# Altium schematic sheet NguyenLI.SchDoc
size B
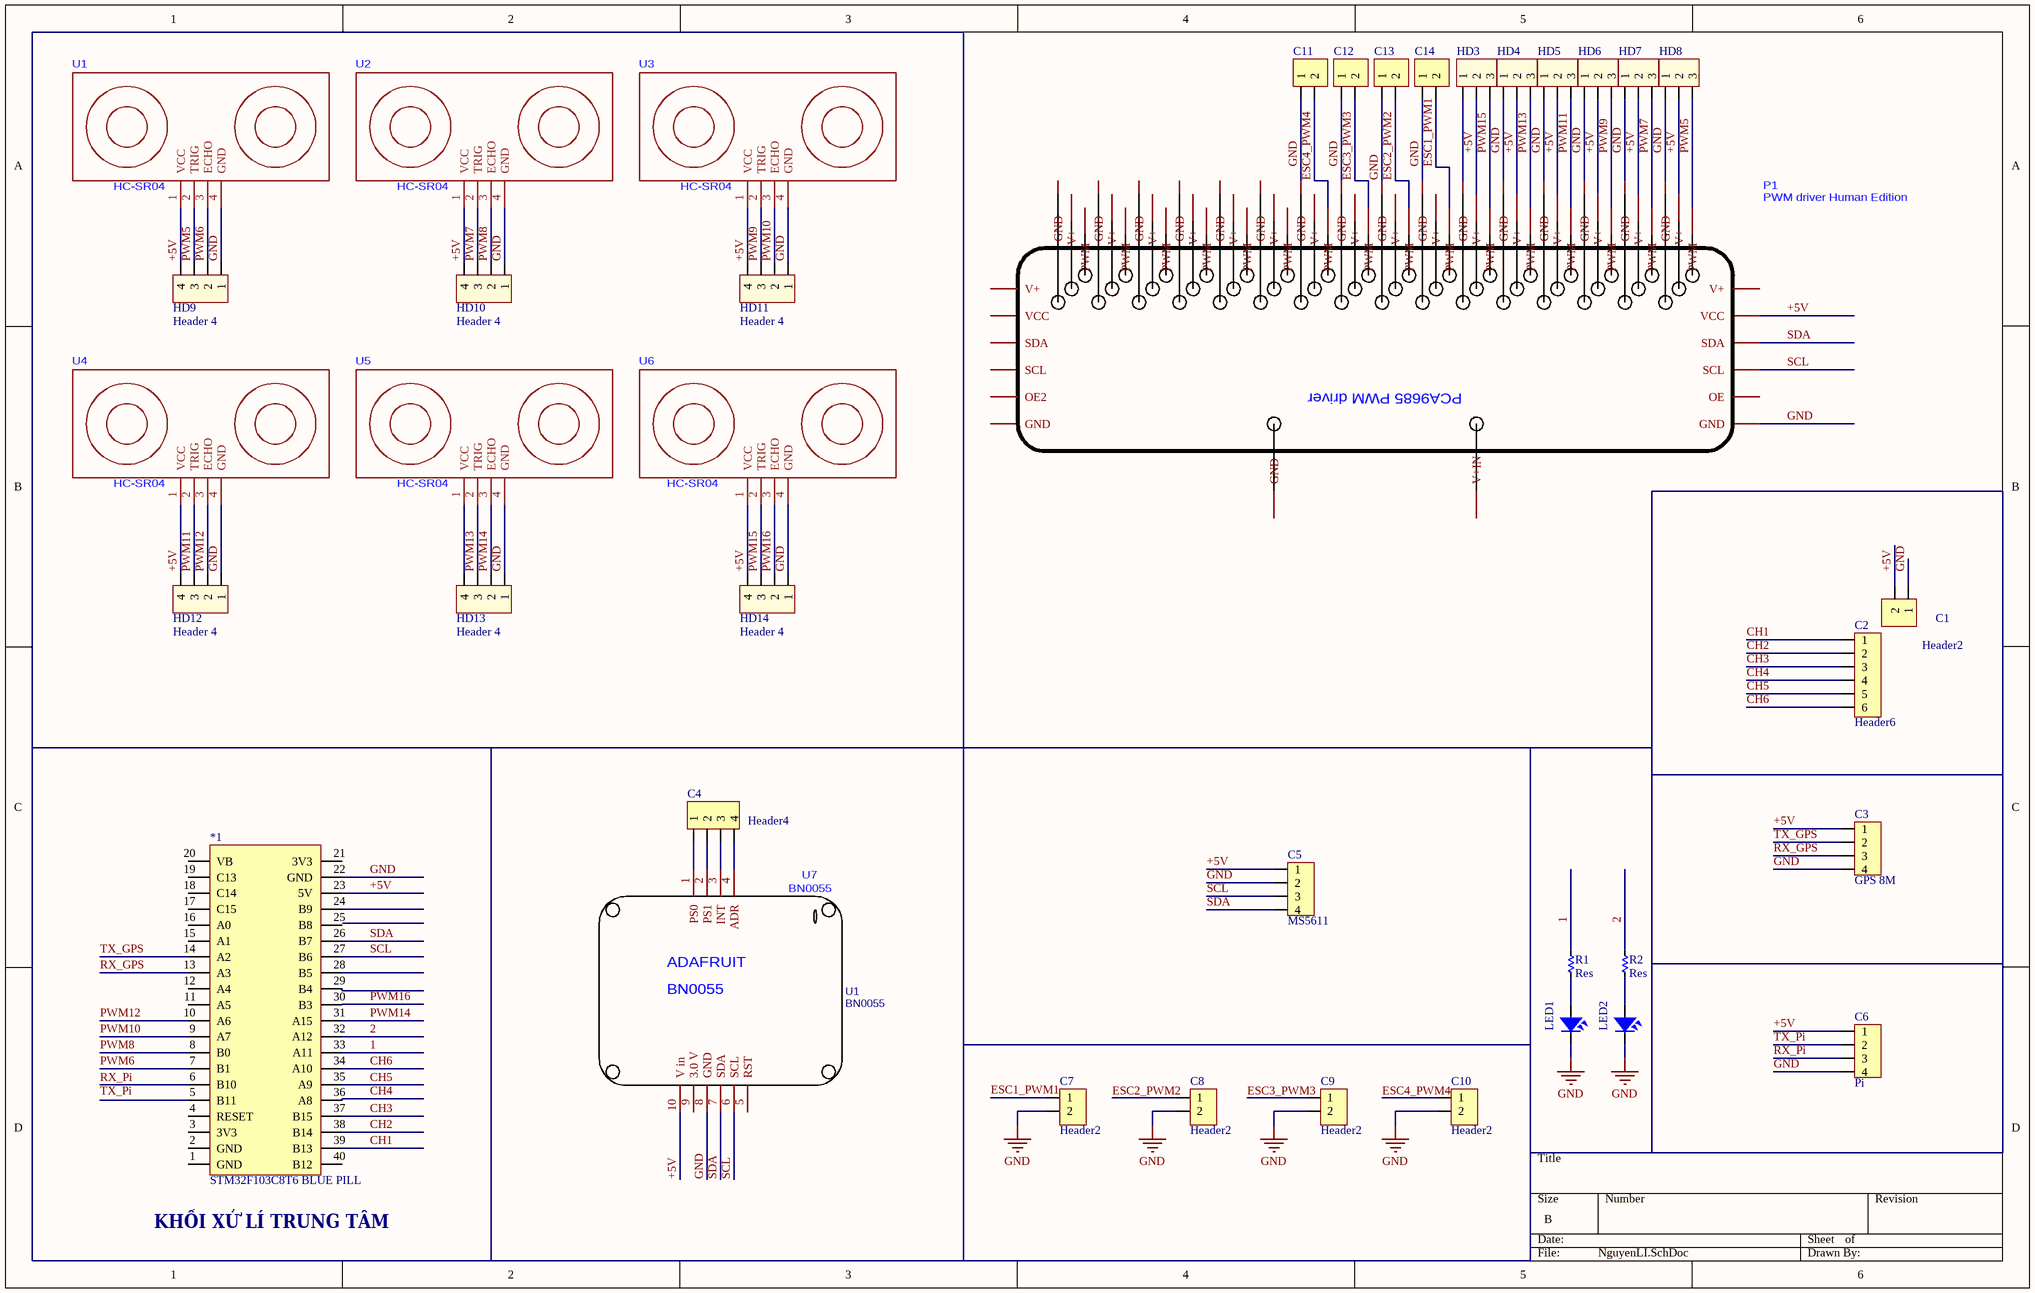
[diagram p0: NguyenLI.SchDoc]

## Parts
*1  STM32F103C8T6 BLUE PILL  [STM32F103 BLUE PILL]
C1  Header2  [HDR2]
C2  Header6  [HDR6]
C3  GPS 8M  [HDR4]
C4  Header4  [HDR4]
C5  MS5611  [HDR4]
C6  Pi  [HDR4]
C7  Header2  [HDR2]
C8  Header2  [HDR2]
C9  Header2  [HDR2]
C10  Header2  [HDR2]
C11  Header2  [HDR2]  (value not drawn)
C12  Header2  [HDR2]  (value not drawn)
C13  Header2  [HDR2]  (value not drawn)
C14  Header2  [HDR2]  (value not drawn)
HD3  (no value)  [HED3]
HD4  (no value)  [HED3]
HD5  (no value)  [HED3]
HD6  (no value)  [HED3]
HD7  (no value)  [HED3]
HD8  (no value)  [HED3]
HD9  Header 4  [HED4B]
HD10  Header 4  [HED4B]
HD11  Header 4  [HED4B]
HD12  Header 4  [HED4B]
HD13  Header 4  [HED4B]
HD14  Header 4  [HED4B]
LED1  LED  [LED-5-RED]  (value not drawn)
LED2  LED  [LED-5-RED]  (value not drawn)
P1  PWM driver Human Edition  [PCA9685]
R1  Res  [RES-1/4W]
R2  Res  [RES-1/4W]
U1  HC-SR04  [HC-SR04]
U2  HC-SR04  [HC-SR04]
U3  HC-SR04  [HC-SR04]
U4  HC-SR04  [HC-SR04]
U5  HC-SR04  [HC-SR04]
U6  HC-SR04  [HC-SR04]
U7  BN0055  [BN0055]

## Nets
GND: *1.22(GND) C1.1 C3.4 C5.2 C6.4 C7.2 C8.2 C9.2 C10.2 C11.1 C12.1 C13.1 C14.1 HD4.1 HD5.1 HD6.1 HD7.1 HD8.1 HD9.1 HD10.1 HD11.1 HD12.1 HD13.1 HD14.1 LED1.2 LED2.2 P1.1(GND) P1.9(GND) P1.12(GND) P1.15(GND) P1.18(GND) P1.21(GND) P1.27(GND) P1.30(GND) P1.33(GND) P1.36(GND) U1.4(GND) U2.4(GND) U3.4(GND) U4.4(GND) U5.4(GND) U6.4(GND) U7.8(GND)
1: *1.33(A11) R1.1
2: *1.32(A12) R2.1
+5V: *1.23(5V) C1.2 C3.1 C5.1 C6.1 HD3.2 HD4.2 HD5.2 HD6.2 HD7.2 HD8.2 HD9.4 HD10.4 HD11.4 HD12.4 HD14.4 P1.5(VCC) P1.8(V+) P1.11(V+) P1.14(V+) P1.17(V+) P1.20(V+) P1.23(V+) U1.1(VCC) U2.1(VCC) U3.1(VCC) U4.1(VCC) U6.1(VCC) U7.10(V_in)
CH1: *1.39(B13) C2.1
CH2: *1.38(B14) C2.2
CH3: *1.37(B15) C2.3
CH4: *1.36(A8) C2.4
CH5: C2.5
CH6: *1.34(A10) C2.6
ESC1_PWM1: C7.1 C14.2 P1.25(PWM)
ESC2_PWM2: C13.2 P1.28(PWM)
ESC3_PWM3: C12.2 P1.31(PWM)
ESC4_PWM4: C11.2 P1.34(PWM)
PWM5: HD8.3 HD9.3 P1.7(PWM) U1.2(TRIG)
PWM6: *1.7(B1) HD9.2 U1.3(ECHO)
PWM7: HD7.3 HD10.3 P1.10(PWM) U2.2(TRIG)
PWM8: *1.8(B0) HD10.2 U2.3(ECHO)
PWM9: HD6.3 HD11.3 P1.13(PWM) U3.2(TRIG)
PWM10: *1.9(A7) HD11.2 U3.3(ECHO)
PWM11: HD5.3 HD12.3 P1.16(PWM) U4.2(TRIG)
PWM12: *1.10(A6) HD12.2 U4.3(ECHO)
PWM13: HD4.3 HD13.3 P1.19(PWM) U5.2(TRIG)
PWM14: *1.31(A15) HD13.2 U5.3(ECHO)
PWM15: HD3.3 HD14.3 P1.22(PWM) U6.2(TRIG)
PWM16: *1.30(B3) HD14.2 U6.3(ECHO)
RX_GPS: *1.13(A3) C3.3
RX_Pi: C6.3
SCL: *1.27(B6) C5.3 P1.3(SCL) U7.6(SCL)
SDA: *1.26(B7) C5.4 P1.4(SDA) U7.7(SDA)
TX_GPS: *1.14(A2) C3.2
TX_Pi: C6.2
NetC4_1: C4.1 U7.1(PS0)
NetC4_2: C4.2 U7.2(PS1)
NetC4_3: C4.3 U7.3(INT)
NetC4_4: C4.4 U7.4(ADR)
NetHD3_1: HD3.1 P1.24(GND)
NetHD13_4: HD13.4 U5.1(VCC)
NetLED1_1: LED1.1 R1.2
NetLED2_1: LED2.1 R2.2

Not connected (* = marked no-connect by the designer): *1 1(GND) 2(GND) 3(3V3) 4(RESET) 5(B11) 6(B10) 11(A5) 12(A4) 15(A1) 16(A0) 17(C15) 18(C14) 19(C13) 20(VB) 21(3V3) 24(B9) 25(B8) 28(B5) 29(B4) 35(A9) 40(B12); C8 1; C9 1; C10 1; P1 2(OE) 6(V+) 26(V+) 29(V+) 32(V+) 35(V+) 37(PWM) 38(V+) 39(GND) 40(PWM) 41(V+) 42(GND) 43(PWM) 44(V+) 45(GND) 46(PWM) 47(V+) 48(GND) 49(PWM) 50(V+) 51(GND) 52(PWM) 53(V+) 54(GND) 55(V+) 56(VCC) 57(SDA) 58(SCL) 59(OE2) 60(GND) 61(V+IN) 62(GND); U7 5(RST) 9(3.0_V)

## Notes on the sheet
- (near *1) KHỐI XỬ LÍ TRUNG TÂM
- Labels drawn without touching a wire or pin: CH5, ESC2_PWM2, ESC3_PWM3, ESC4_PWM4, RX_Pi, TX_Pi
- (in symbol BN0055) ADAFRUIT; U1
- (in symbol PWM driver Human Edition) PCA9685 PWM driver

## Library data of the parts
C1 C7-C14 = Header2: Header IDC, 2 x 1 Pin Vertical 2.54mm Pitch (Non-Boxed, Male); Manufacturer: W¨¹rth Elektronik eiSos GmbH; partNo: 613002143121; ComponentLink1 Description: Manufacturer; ComponentLink2 Description: Datasheet; NoPins: 02; Created Date: 29 March 2013; ComponentLink1URL: http://www.we-online.com; ComponentLink2URL: http://katalog.we-online.de/em/datasheet/6130xx143121.pdf; Created by: Karrer Zheng
C2 = Header6: Header IDC, 6 x 1 Pin Vertical 2.54mm Pitch (Non-Boxed, Male); Manufacturer: W¨¹rth Elektronik eiSos GmbH; partNo: 613002143121; ComponentLink1 Description: Manufacturer; ComponentLink2 Description: Datasheet; NoPins: 02; Created Date: 29 March 2013; ComponentLink1URL: http://www.we-online.com; ComponentLink2URL: http://katalog.we-online.de/em/datasheet/6130xx143121.pdf; Created by: Karrer Zheng
C3-C6 = Header4: Header IDC, 4 x 1 Pin Vertical 2.54mm Pitch (Non-Boxed, Male); Manufacturer: W¨¹rth Elektronik eiSos GmbH; partNo: 613002143121; ComponentLink1 Description: Manufacturer; ComponentLink2 Description: Datasheet; NoPins: 02; Created Date: 29 March 2013; ComponentLink1URL: http://www.we-online.com; ComponentLink2URL: http://katalog.we-online.de/em/datasheet/6130xx143121.pdf; Created by: Karrer Zheng
HD3-HD8 = Hed3: Header 3 (Green); Value: Header 3
HD9-HD14 = Hed4: Header 4 (Green); Value: Header 4
LED1 LED2 = LED: LED Single colour Green and Red; Value: LED 3 ly Single Colour
R1 R2 = Res: Manufacturer: Generic Components; Class: Passive; SubClass: R; Published: 08/06/2000; Publisher: Altium Hobart Technology Centre